# Altium schematic sheet Schematic.SchDoc
size A; SheetNumber: 1; SheetTotal: 1
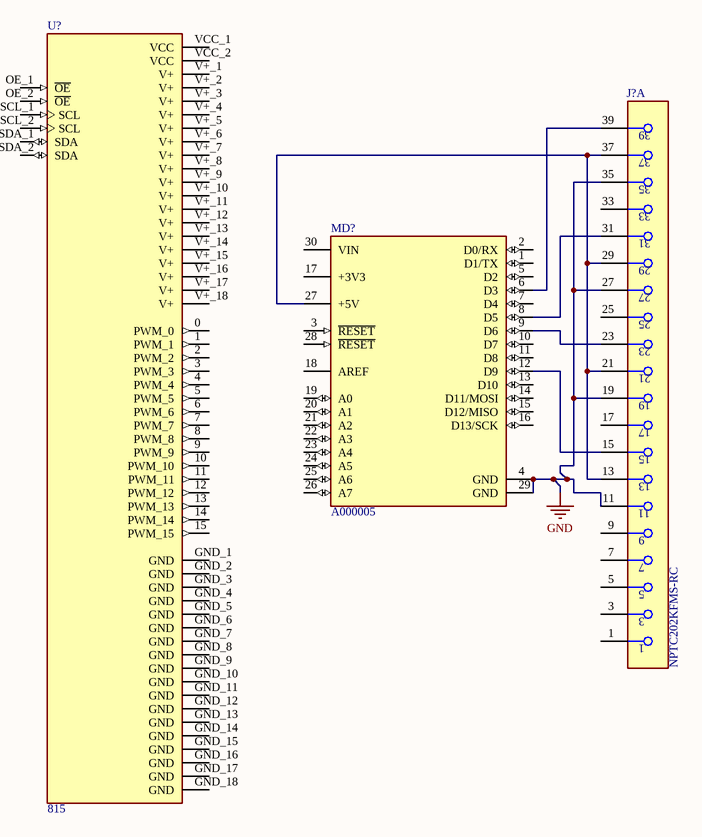
[diagram p0: Schematic.SchDoc]

## Parts
J?  NPTC202KFMS-RC  [FP-NPTC202KFMS-RC-MFG]  (part A of 2)
MD?  A000005  [FP-A000005-MFG]
U?  815  [MODULE_815]

## Nets
GND: J?.11 J?.19 J?.27 J?.35 MD?.4(GND) MD?.29(GND)
NetJ?_13: J?.13 J?.21 J?.29 J?.37 MD?.27(+5V)
NetJ?_15: J?.15 MD?.12(D9)
NetJ?_23: J?.23 MD?.9(D6)
NetJ?_31: J?.31 MD?.8(D5)
NetJ?_39: J?.39 MD?.6(D3)

Not connected (* = marked no-connect by the designer): J? 1 3 5 7 9 17 25 33; MD? 1(D1/TX) 2(D0/RX) 3(~{RESET}) 5(D2) 7(D4) 10(D7) 11(D8) 13(D10) 14(D11/MOSI) 15(D12/MISO) 16(D13/SCK) 17(+3V3) 18(AREF) 19(A0) 20(A1) 21(A2) 22(A3) 23(A4) 24(A5) 25(A6) 26(A7) 28(~{RESET}) 30(VIN); U? 0(PWM_0) 1(PWM_1) 2(PWM_2) 3(PWM_3) 4(PWM_4) 5(PWM_5) 6(PWM_6) 7(PWM_7) 8(PWM_8) 9(PWM_9) 10(PWM_10) 11(PWM_11) 12(PWM_12) 13(PWM_13) 14(PWM_14) 15(PWM_15) GND_1(GND) GND_2(GND) GND_3(GND) GND_4(GND) GND_5(GND) GND_6(GND) GND_7(GND) GND_8(GND) GND_9(GND) GND_10(GND) GND_11(GND) GND_12(GND) GND_13(GND) GND_14(GND) GND_15(GND) GND_16(GND) GND_17(GND) GND_18(GND) OE_1(~{OE}) OE_2(~{OE}) SCL_1(SCL) SCL_2(SCL) SDA_1(SDA) SDA_2(SDA) V+_1(V+) V+_2(V+) V+_3(V+) V+_4(V+) V+_5(V+) V+_6(V+) V+_7(V+) V+_8(V+) V+_9(V+) V+_10(V+) V+_11(V+) V+_12(V+) V+_13(V+) V+_14(V+) V+_15(V+) V+_16(V+) V+_17(V+) V+_18(V+) VCC_1(VCC) VCC_2(VCC)

## Library data of the parts
J? = CMP-25680-000011-1: CONN HDR 40POS 0.1 TIN SMD; Manufacturer: Sullins Connector Solutions; Pitch: 2.54mm; Conn Gender: Female; Voltage Rating: 250V; Current Rating: 3A; Number Of Contacts: 40; Is Female: yes; Conn Orientation: Straight; Category: Conn; RoHS: TRUE; Lead Free: Yes; Device Class L2: Headers and Wire Housings; Temperature: -40°C to +105°C; Contact Material: Tin,Nickel; Device Class L1: Connectors; Digikey Description: CONN HDR 40POS 0.1 TIN SMD; ComponentLink2Description: Datasheet; ComponentLink2URL: https://s3.amazonaws.com/catalogspreads-pdf/PAGE118-119%20.100%20FEMALE%20HDR.pdf; Height: 7.75mm; Footprint Url: https://drawings-pdf.s3.amazonaws.com/10488.pdf; Temperature Range Low: -40°C; Manufacturer Part Number: NPTC202KFMS-RC; Device Class L3: unset; Automotive: No; Octopart: https://octopart.com/nptc202kfms-rc-sullins-270594; Number Of Rows: 2; Temperature Range High: +105°C; Package: 0
MD? = CMP-189986-000002-1: ARDUINO NANO ATMEGA328 EVAL BRD; Number of Bits: 8; Evaluation Kit: Yes; Operating Supply Voltage: 12V; Interface: I2C; Data Bus Width: 8b; Core Architecture: AVR; Packaging: Bulk; Length: 7inch; Package Quantity: 50; Width: 5inch; REACH SVHC: No SVHC; Weight: 0.358383oz; Series: AVR® ATmega; Height: 0.25inch
U? = 815: Adafruit 16-Channel 12-bit PWM/Servo Driver - I2C interface - PCA9685; SnapEDA_Link: https://www.snapeda.com/parts/815/Adafruit+Industries/view-part/?ref=snap; Package: Non-Standard Adafruit; Value: *; MF: Adafruit; MP: 815; Check_prices: https://www.snapeda.com/parts/815/Adafruit+Industries/view-part/?ref=eda